# EAGLE design Qwiic_Spectral_Sensor-AS7265x-Offset-BottomJig (EAGLE 9.2.1)
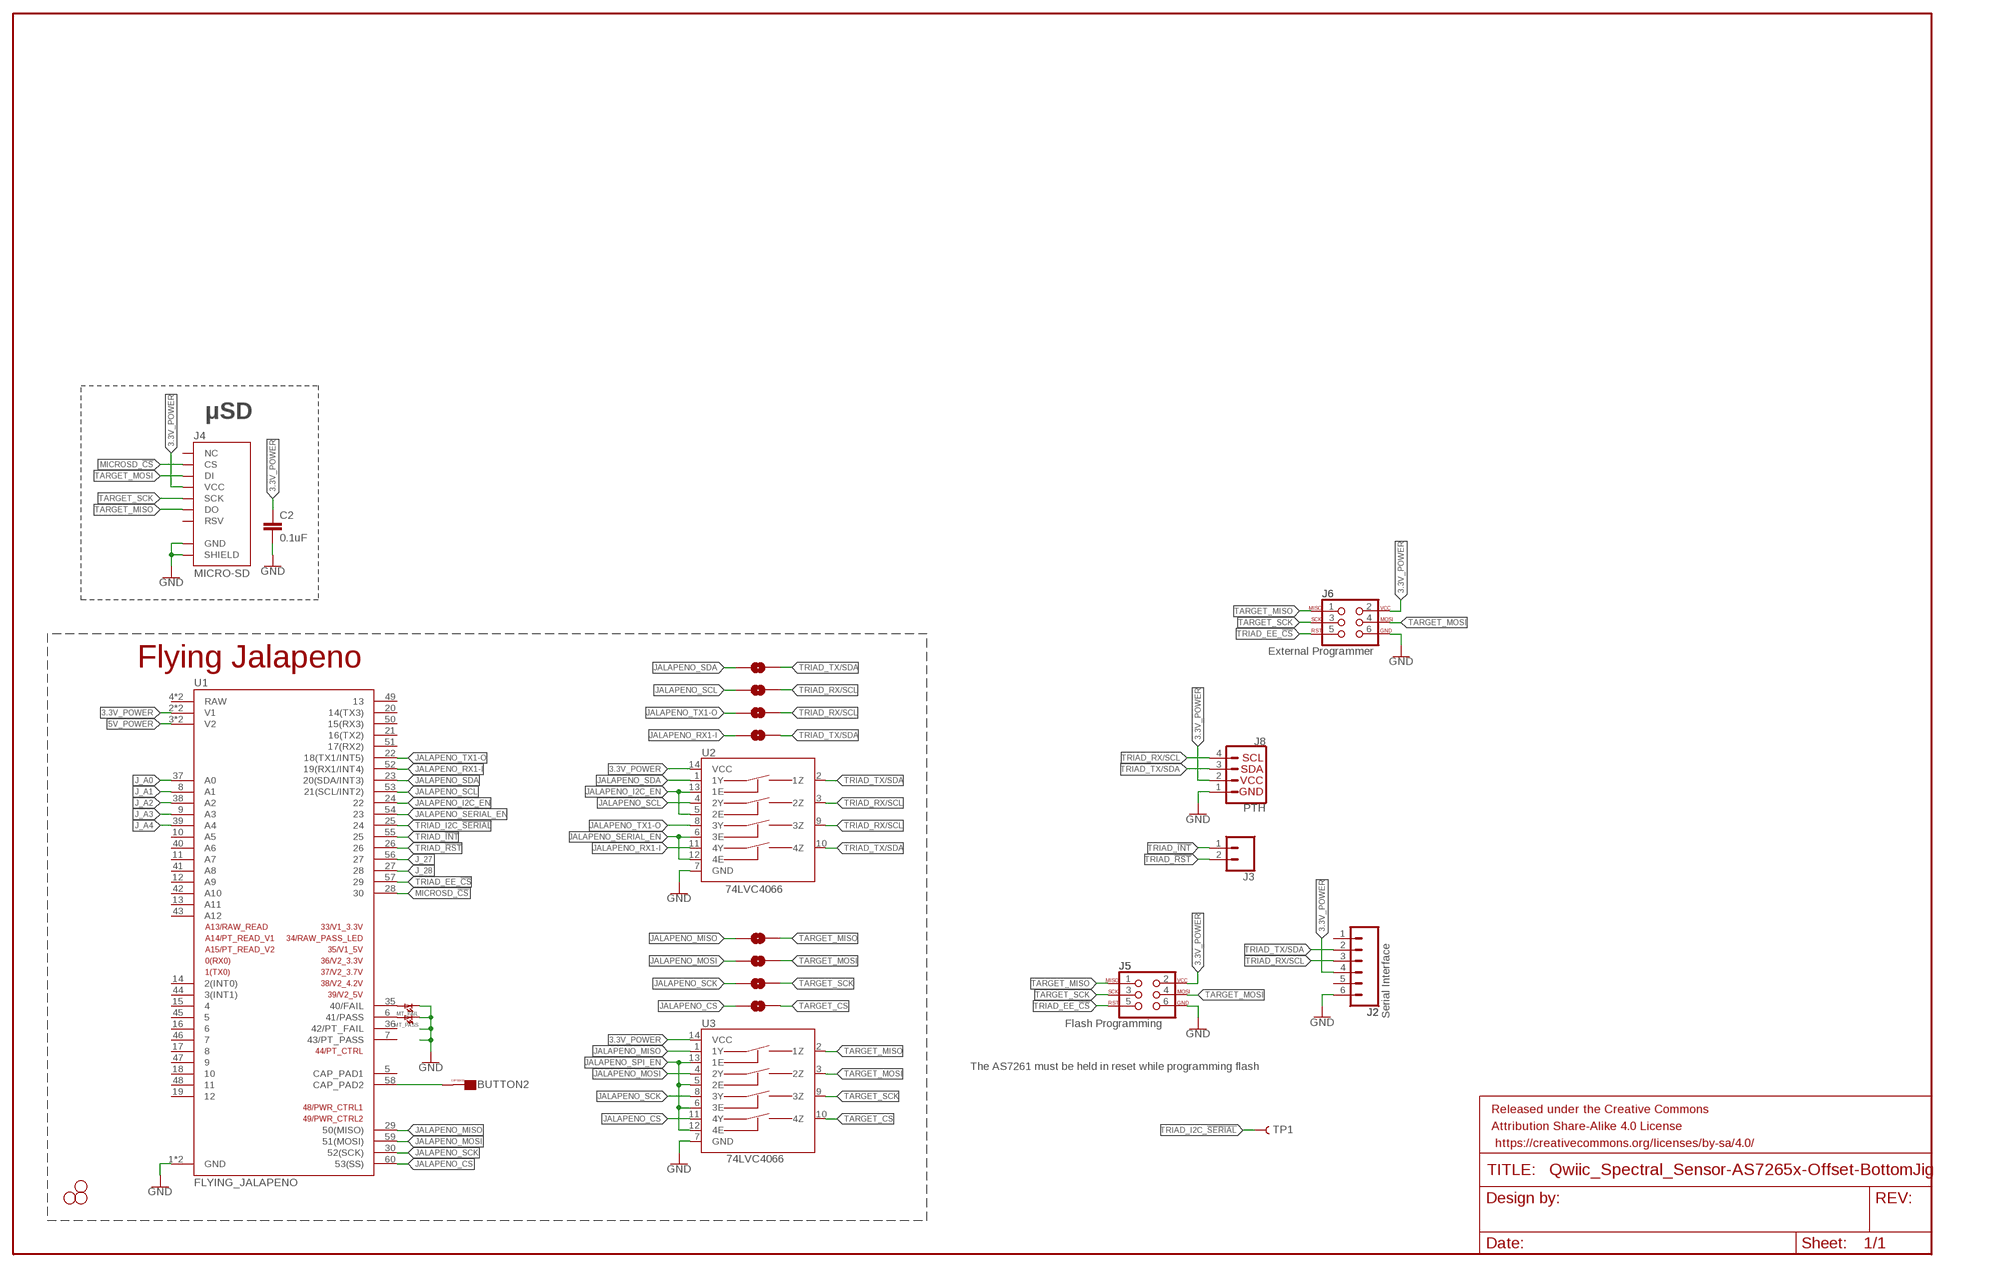
[diagram p0: schematic, sheet 1]

## Parts
BUTTON2  CAPSENSE_BUTTON_PAD_ONLY  [CAPSENSE_BUTTON_PADS_ONLY]
C2  0.1uF  0.1UF-0603-25V-(+80/-20%)  [0603]
FRAME2  FRAME-LEDGER  [CREATIVE_COMMONS]
H1  STAND-OFF  [STAND-OFF]
H3  STAND-OFF  [STAND-OFF]
H4  STAND-OFF  [STAND-OFF]
J2  Serial Interface  CONN_06NO_SILK_FEMALE_PTH  [1X06_NO_SILK]
J3  CONN_021X02_NO_SILK  [1X02_NO_SILK]
J4  MICRO-SD  MICRO-SD_CARD_SOCKETPUSH-PUSH  [MICRO-SD-SOCKET]
J5  Flash Programming  AVR_SPI_PROG_3X2NS  [2X3-NS]
J6  External Programmer  AVR_SPI_PROG_3X2NS  [2X3-NS]
J8  PTH  I2C_STANDARD_NO_SILK  [1X04_NO_SILK]
J_SCL  JUMPER-SMT_2_NO_NO-SILK  [SMT-JUMPER_2_NO_NO-SILK]
J_SCL1  JUMPER-SMT_2_NO_NO-SILK  [SMT-JUMPER_2_NO_NO-SILK]
J_SCL2  JUMPER-SMT_2_NO_NO-SILK  [SMT-JUMPER_2_NO_NO-SILK]
J_SCL3  JUMPER-SMT_2_NO_NO-SILK  [SMT-JUMPER_2_NO_NO-SILK]
J_SCL4  JUMPER-SMT_2_NO_NO-SILK  [SMT-JUMPER_2_NO_NO-SILK]
J_SCL5  JUMPER-SMT_2_NO_NO-SILK  [SMT-JUMPER_2_NO_NO-SILK]
J_SDA  JUMPER-SMT_2_NO_NO-SILK  [SMT-JUMPER_2_NO_NO-SILK]
J_SDA1  JUMPER-SMT_2_NO_NO-SILK  [SMT-JUMPER_2_NO_NO-SILK]
MT_FAIL  LED1206  [LED-1206]
MT_PASS  LED1206  [LED-1206]
TP1  TEST-POINTPOGO_PTH  [1X01_NO_SILK]
U1  FLYING_JALAPENO  FLYING_JALAPENO_V3MALE  [FLYING_JALAPENO_V3_M]
U2  74LVC4066  74LVC4066_MUX_1:1_X4  [SO14]
U3  74LVC4066  74LVC4066_MUX_1:1_X4  [SO14]

## Nets
3.3V_POWER [VCC]: C2.1 J2.4 J4.VCC J5.2 J6.2 J8.2 U1.2(V1) U1.32(V1) U2.14(VCC) U3.14(VCC)
5V_POWER [POWA]: U1.3(V2) U1.33(V2)
BUTTON2 [CAPSENSE]: BUTTON2.CAPSENSE_PAD(CAPSENSE) U1.58(CAP_PAD2)
GND: C2.2 J2.6 J4.CD1(SHIELD) J4.GND J5.6 J6.6 J8.1 MT_FAIL.C MT_PASS.C U1.1(GND) U1.31(GND) U2.7(GND) U3.7(GND)
J_27: U1.56
J_28: U1.27
J_A0: U1.37(A0)
J_A1: U1.8(A1)
J_A2: U1.38(A2)
J_A3: U1.9(A3)
J_A4: U1.39(A4)
JALAPENO_CS: J_SDA1.1 U1.60(53(SS)) U3.11(4Y)
JALAPENO_I2C_EN: U1.24 U2.5(2E) U2.13(1E)
JALAPENO_MISO: J_SCL5.1 U1.29(50(MISO)) U3.1(1Y)
JALAPENO_MOSI: J_SCL3.1 U1.59(51(MOSI)) U3.4(2Y)
JALAPENO_RX1-I: J_SDA.1 U1.52(19(RX1/INT4)) U2.11(4Y)
JALAPENO_SCK: J_SCL4.1 U1.30(52(SCK)) U3.8(3Y)
JALAPENO_SCL: J_SCL.1 U1.53(21(SCL/INT2)) U2.4(2Y)
JALAPENO_SDA: J_SCL2.1 U1.23(20(SDA/INT3)) U2.1(1Y)
JALAPENO_SERIAL_EN: U1.54 U2.6(3E) U2.12(4E)
JALAPENO_SPI_EN: U3.5(2E) U3.6(3E) U3.12(4E) U3.13(1E)
JALAPENO_TX1-O: J_SCL1.1 U1.22(18(TX1/INT5)) U2.8(3Y)
MICROSD_!CS!: J4.CS U1.28
N$15: MT_PASS.A U1.6(41/PASS)
N$16: MT_FAIL.A U1.35(40/FAIL)
TARGET_CS: J_SDA1.2 U3.10(4Z)
TARGET_MISO: J4.DO J5.1 J6.1 J_SCL5.2 U3.2(1Z)
TARGET_MOSI: J4.DI J5.4 J6.4 J_SCL3.2 U3.3(2Z)
TARGET_SCK: J4.SCLK(SCK) J5.3 J6.3 J_SCL4.2 U3.9(3Z)
TRIAD_!INT!: J3.1 U1.55
TRIAD_!RST!: J3.2 U1.26
TRIAD_EE_!CS!: J5.5 J6.5 U1.57
TRIAD_I2C_!SERIAL!: TP1.1 U1.25
TRIAD_RX/SCL: J2.3 J8.4 J_SCL1.2 J_SCL.2 U2.3(2Z) U2.9(3Z)
TRIAD_TX/SDA: J2.2 J8.3 J_SCL2.2 J_SDA.2 U2.2(1Z) U2.10(4Z)
Unconnected: J2.1 J2.5 J4.RSV1(RSV) J4.RSV2(NC) U1.4(RAW) U1.5(CAP_PAD1) U1.7(43/PT_PASS) U1.10(A5) U1.11(A7) U1.12(A9) U1.13(A11) U1.14(2(INT0)) U1.15 U1.16 U1.17 U1.18 U1.19 U1.20(14(TX3)) U1.21(16(TX2)) U1.34(RAW) U1.36(42/PT_FAIL) U1.40(A6) U1.41(A8) U1.42(A10) U1.43(A12) U1.44(3(INT1)) U1.45 U1.46 U1.47 U1.48 U1.49 U1.50(15(RX3)) U1.51(17(RX2))

## Notes on the sheet
- μSD
- Flying Jalapeno
- The AS7261 must be held in reset while programming flash

## Library data of the parts
BUTTON2 = Testing:CAPSENSE_BUTTON_PAD_ONLY
C2 = SparkFun-Capacitors:0.1UF: 0.1µF ceramic capacitors A capacitor is a passive two-terminal electrical component used to store electrical energy temporarily in an electric field.; PROD_ID: CAP-00810
FRAME2 = SparkFun-Aesthetics:FRAME-LEDGER: Schematic Frame - Ledger Standard 11x14 US Ledger frame
H1 H3 H4 = SparkFun-Hardware:STAND-OFF: Stand Off Drill holes for mechanically mounting via screws, standoffs, etc. Note: Use the keepout ring to avoid running the screw head into surrounding components. Variant Overviews STAND-OFF - Mechanical footprint for a #4 phillips button head screw. STAND-OFF-TIGHT - Mechanical footprint for a #4 phillips button head screw, Example SparkFun Products Screw - Phillips Head (1/4", 4-40, 10 pack) <https://www.sparkfun.com/products/10453> (PRT-10453) Screw - Phillips Head (1/2", 4-40, 10 pack) <https://www.sparkfun.com/products/10452> (PRT-10452) Screw - Phillips Head (3/4", 4-40, 10 pack) <https://www.sparkfun.com/products/10451> (PRT-10451) Screw - Phillips Head (1", 4-40, 10 pack) <https://www.sparkfun.com/products/10450> (PRT-10450)
J2 = SparkFun-Connectors:CONN_06: Multi connection point. Often used as Generic Header-pin footprint for 0.1 inch spaced/style header connections On any of the 0.1 inch spaced packages, you can populate with these: Break Away Headers - Straight <https://www.sparkfun.com/products/116> (PRT-00116) Break Away Male Headers - Right Angle <https://www.sparkfun.com/products/553> (PRT-00553) Female Headers <https://www.sparkfun.com/products/115> (PRT-00115) Break Away Headers - Machine Pin <https://www.sparkfun.com/products/117> (PRT-00117) Break Away Female Headers - Swiss Machine Pin <https://www.sparkfun.com/products/743> (PRT-00743) Arduino Stackable Header - 6 Pin <https://www.sparkfun.com/products/9280> (PRT-09280) For SCREWTERMINALS and SPRING TERMINALS visit here: Screw Terimnals on SparkFun.com <https://www.sparkfun.com/search/results?term=Screw+Terminals> (5mm/3.5mm/2.54mm spacing) This device is also useful as a general connection point to wire up your design to another part of your project. Our various solder wires solder well into these plated through hole pads. Hook-Up Wire - Assortment (Stranded, 22 AWG) <https://www.sparkfun.com/products/11375> (PRT-11375) Hook-Up Wire - Assortment (Solid Core, 22 AWG) <https://www.sparkfun.com/products/11367> (PRT-11367) View the entire wire category on our website here <https://www.sparkfun.com/categories/141>; PROD_ID: CONN-08437
J3 = SparkFun-Connectors:CONN_02: Multi connection point. Often used as Generic Header-pin footprint for 0.1 inch spaced/style header connections On any of the 0.1 inch spaced packages, you can populate with these: Break Away Headers - Straight <https://www.sparkfun.com/products/116> (PRT-00116) Break Away Male Headers - Right Angle <https://www.sparkfun.com/products/553> (PRT-00553) Female Headers <https://www.sparkfun.com/products/115> (PRT-00115) Break Away Headers - Machine Pin <https://www.sparkfun.com/products/117> (PRT-00117) Break Away Female Headers - Swiss Machine Pin <https://www.sparkfun.com/products/743> (PRT-00743) For SCREWTERMINALS and SPRING TERMINALS visit here: Screw Terimnals on SparkFun.com <https://www.sparkfun.com/search/results?term=Screw+Terminals> (5mm/3.5mm/2.54mm spacing) This device is also useful as a general connection point to wire up your design to another part of your project. Our various solder wires solder well into these plated through hole pads. Hook-Up Wire - Assortment (Stranded, 22 AWG) <https://www.sparkfun.com/products/11375> (PRT-11375) Hook-Up Wire - Assortment (Solid Core, 22 AWG) <https://www.sparkfun.com/products/11367> (PRT-11367) View the entire wire category on our website here <https://www.sparkfun.com/categories/141> Special notes: Molex polarized connector foot print use with: PRT-08233 with associated crimp pins and housings. 2.54_SCREWTERM for use with PRT-10571. 3.5mm Screw Terminal footprints for PRT-08084 5mm Screw Terminal footprints for use with PRT-08432
J4 = SparkFun-Connectors:MICRO-SD_CARD_SOCKET: microSD Socket for Transflash Push-push type µSD socket. tDoc lines correctly indicate media card edge positions when inserting (unlocked, locked, depressed). NOTE: CD1 and CD2 are connected internally, and the default detect state of the socket is detect pin to ground. SparkFun Products: WAV Trigger <https://www.sparkfun.com/products/13660> CAN-Bus Shield <https://www.sparkfun.com/products/13262> SparkFun Level Shifing microSD Breakout <https://www.sparkfun.com/products/13743>; PROD_ID: CONN-07820
J5 J6 = SparkFun-Connectors:AVR_SPI_PROG_3X2: AVR ISP 6 Pin This is the reduced ISP connector for AVR programming. Common on Arduino. This footprint will take up less PCB space and can be used with a 10-pin to 6-pin adapter such as SKU: BOB-08508 **Special note about "TEST_POINT" package. The stop mask is on the top side, so if you want your programming test points to be on the bottom of your board, make sure to place this package on the bottom side of the board. This also ensure that the orientation to program from the bottom side will be correct. SparkFun Products: SparkFun ISP Pogo Adapter <https://www.sparkfun.com/products/11591> - NS Tiny AVR Programmer <https://www.sparkfun.com/products/11801> -PTH
J8 = SparkFun-Connectors:I2C_STANDARD: SparkFun I2C Standard Pinout Header SparkFun has standardized on a pinout for all I2C based sensor breakouts. This pinout allows I2C boards to be plugged directly into the headers on Arduino Uno compatible boards, and to be daisy chained easily. Example SparkFun Products: SparkFun Atmospheric Sensor Breakout - BME280 <https://www.sparkfun.com/products/13676> SparkFun Altitude/Pressure Sensor Breakout - MPL3115A2 <https://www.sparkfun.com/products/11084> SparkFun TOF Range Finder Sensor - VL6180 <https://www.sparkfun.com/products/12785>
J_SCL J_SCL1-J_SCL5 J_SDA J_SDA1 = SparkFun-Jumpers:JUMPER-SMT_2_NO: Normally open jumper This jumper has two pads in close proximity to each other. Apply solder to close the connection. Round pads are easier to solder for beginners, but are a lot larger. SparkFun Product that uses the round pads: SparkFun EL Sequencer <https://www.sparkfun.com/products/12781>
MT_FAIL MT_PASS = Testing:LED: LEDs Standard schematic elements and footprints for 5mm, 3mm, 1206, and 0603 sized LEDs. 5mm - Spark Fun Electronics SKU : COM-00529 (and others)
TP1 = SparkFun-Connectors:TEST-POINT: SparkFun Test Points Bare copper test points for troubleshooting or In-Circuit-Testing. These are used by our Production team for verifying production board runs using pogo-pins on test beds. SparkFun Products: SparkFun LSM9DS1 Breakout <https://www.sparkfun.com/products/13284> SparkFun PSOC <https://www.sparkfun.com/products/13714> SparkFun Load Cell Amplifier <https://www.sparkfun.com/products/13879>
U1 = Testing:FLYING_JALAPENO_V3
U2 U3 = Testing:74LVC4066_MUX_1:1_X4

## Net classes
1 VCC: width 0.381 mm
2 POWA: width 0.61 mm
3 CAPSENSE: width 0.508 mm

## Board
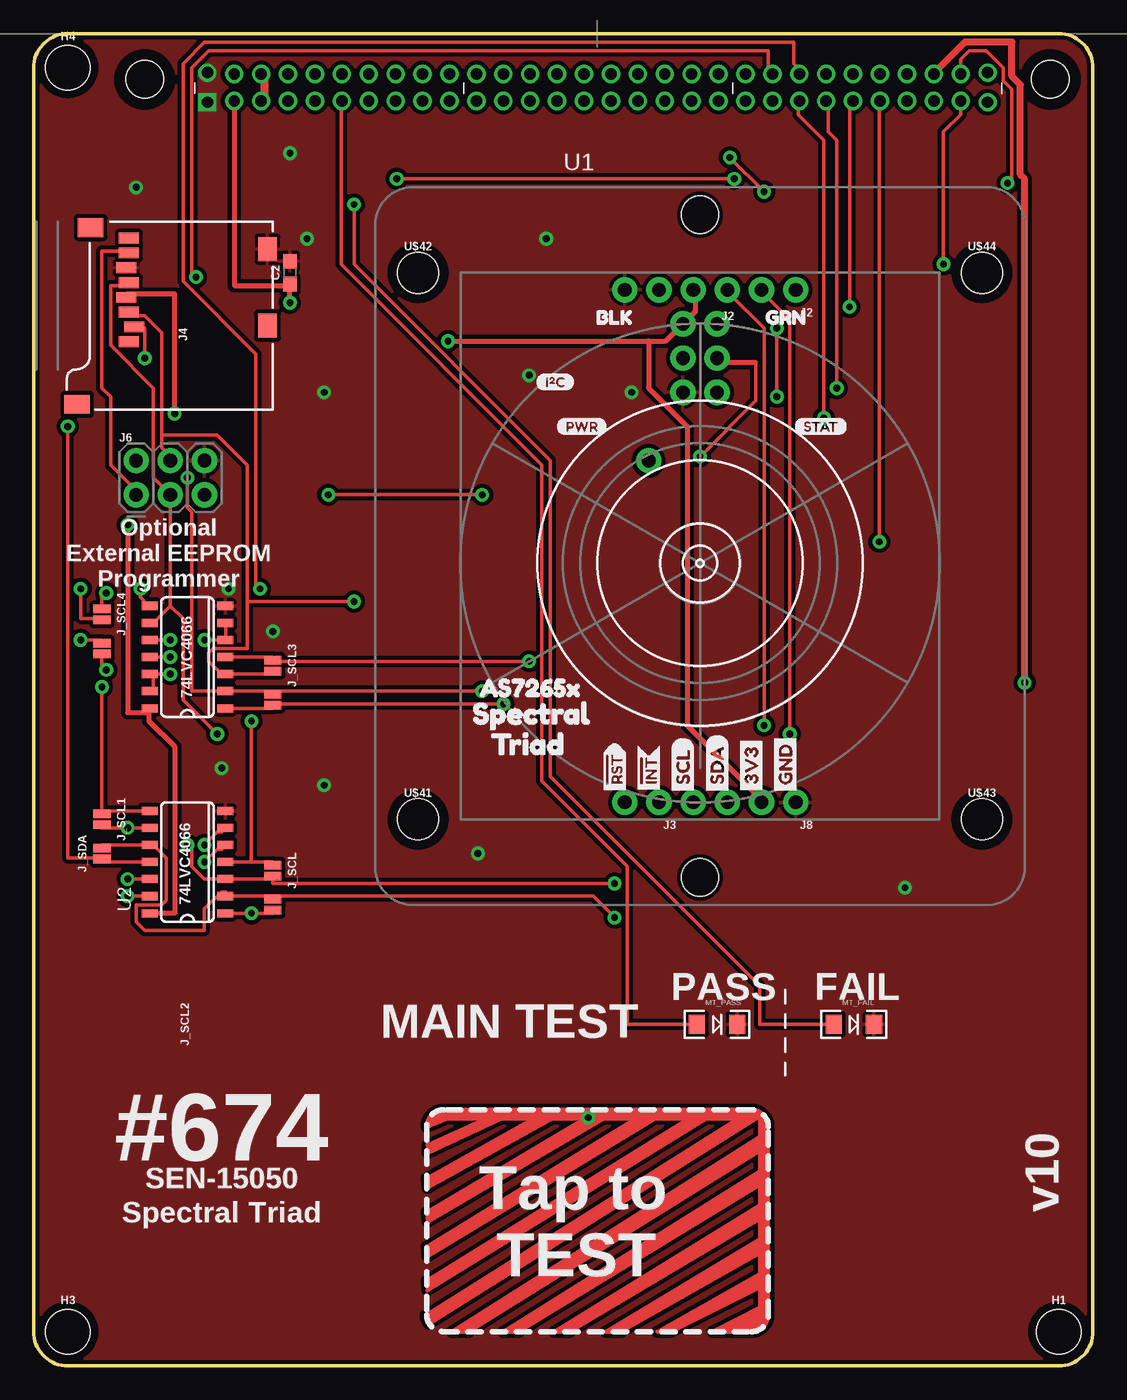
[diagram p1: board, top side]
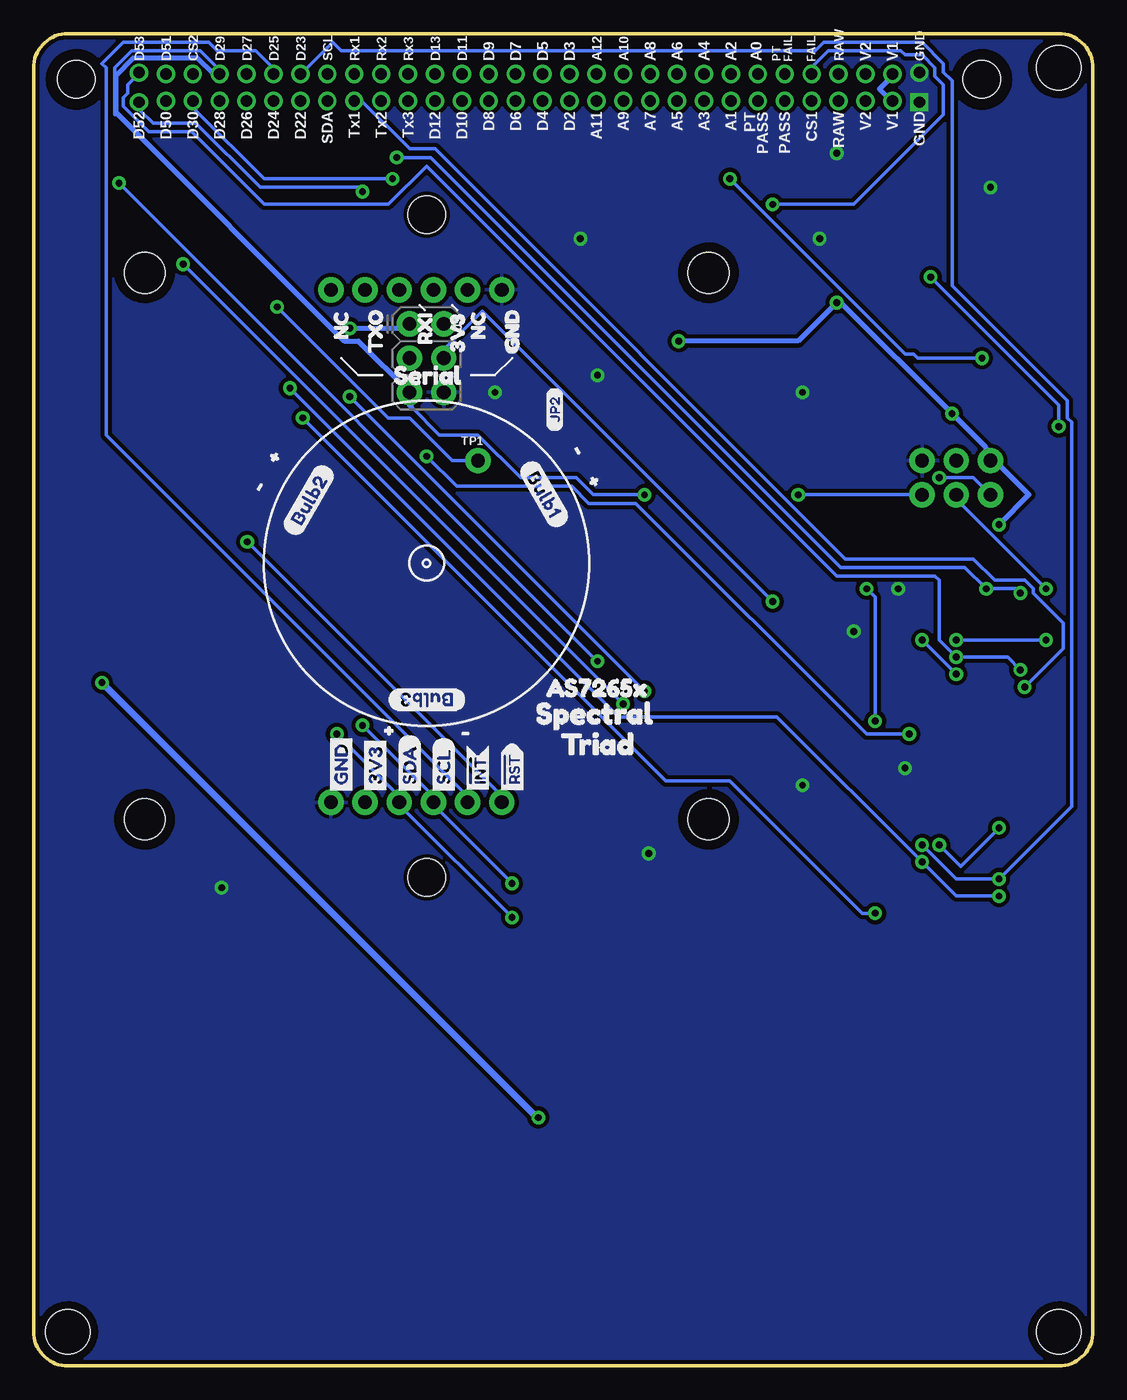
[diagram p2: board, bottom side, seen from below]

Size 78.74 x 99.06 mm. Coordinates in mm from the lower left corner, seen from the top.
Outline: 2.54,99.06 76.2,99.06 arc-90 78.74,96.52 78.74,2.54 arc-90 76.2,0 2.54,0 arc-90 0,2.54 0,96.52 arc-90 2.54,99.06
Copper layers (1*16): Top 0.035mm / dielectric 1.5mm / Bottom 0.035mm
Design rules "SparkFun-2-layer-STANDARD": minimum track width 10mil, minimum drill 20mil, track to track 10mil, track to pad 8mil, pad to pad 8mil, via to via 10mil, smd to smd 8mil, copper to edge 8mil, drill to drill 8mil, minimum pad ring 10mil, minimum via ring 10mil, stop-mask expansion 4mil, vias tented up to drill 25mil, thermal gap 10mil

### Footprints (pad centres in the part's own frame; a part is rotated, then mirrored left to right if it is on the bottom)
CAPSENSE_BUTTON_PADS_ONLY = drill 0.508: CAPSENSE_PAD -0.686,7.036
0603 = smd 1.1 x 1: 1 -0.85,0; 2 0.85,0
STAND-OFF = hole 3.302: 0,0
1X06_NO_SILK = drill 1.016 pad 1.88: 1 0,0; 2 2.54,0; 3 5.08,0; 4 7.62,0; 5 10.16,0; 6 12.7,0
1X02_NO_SILK = drill 1.016 pad 1.88: 1 0,0; 2 2.54,0
MICRO-SD-SOCKET = smd 1.8 x 1.4: CD1 -2.05,0.4; CD2 -7.75,0.4 | smd 0.8 x 1.5: CS -7.84,10.3; DI -6.74,10.7; DO -2.34,10.7; GND -3.44,10.9; RSV1 -8.94,10.7; RSV2 -1.24,10.7; SCLK -4.54,10.7; VCC -5.64,10.9 | smd 1.4 x 1.9: GND1 -13.6,14.55; GND3 -0.45,13.55
2X3-NS = drill 1.016 pad 1.88: 1 -2.54,-1.27; 2 -2.54,1.27; 3 0,-1.27; 4 0,1.27; 5 2.54,-1.27; 6 2.54,1.27
1X04_NO_SILK = drill 1.016 pad 1.88: 1 0,0; 2 2.54,0; 3 5.08,0; 4 7.62,0
SMT-JUMPER_2_NO_NO-SILK = smd 0.635 x 1.27: 1 -0.406,0; 2 0.406,0
LED-1206 = smd 1.2 x 1.4: A -1.5,0; C 1.5,0
1X01_NO_SILK = drill 1.016 pad 1.88: 1 0,0
FLYING_JALAPENO_V3_M = drill 0.85 square: 1 -29,-5.1 | drill 0.85: 2 -27,-5; 3 -25,-5; 4 -23,-5; 5 -21,-5; 6 -19,-5; 7 -17,-5; 8 -15,-5; 9 -13,-5; 10 -11,-5; 11 -9,-5; 12 -7,-5; 13 -5,-5; 14 -3,-5; 15 -1,-5; 16 1,-5; 17 3,-5; 18 5,-5; 19 7,-5; 20 9,-5; 21 11,-5; 22 13,-5; 23 15,-5; 24 17,-5; 25 19,-5; 26 21,-5; 27 23,-5; 28 25,-5; 29 27,-5; 30 29,-5.1; 31 -29,-2.9; 32 -27,-3; 33 -25,-3; 34 -23,-3; 35 -21,-3; 36 -19,-3; 37 -17,-3; 38 -15,-3; 39 -13,-3; 40 -11,-3; 41 -9,-3; 42 -7,-3; 43 -5,-3; 44 -3,-3; 45 -1,-3; 46 1,-3; 47 3,-3; 48 5,-3; 49 7,-3; 50 9,-3; 51 11,-3; 52 13,-3; 53 15,-3; 54 17,-3; 55 19,-3; 56 21,-3; 57 23,-3; 58 25,-3; 59 27,-3; 60 29,-2.9 | hole 2.794: 33.655,-3.404; -33.655,-3.404
SO14 = smd 0.6 x 1.2: 1 -3.175,-2.8; 2 -1.905,-2.8; 3 -0.635,-2.8; 4 0.635,-2.8; 5 1.905,-2.8; 6 3.175,-2.8; 7 4.445,-2.8; 8 4.445,2.8; 9 3.175,2.8; 10 1.905,2.8; 11 0.635,2.8; 12 -0.635,2.8; 13 -1.905,2.8; 14 -3.175,2.8
STAND-OFF-TIGHT = hole 3.048: 0,0
NUBBIN_LOCKER = hole 2.794: 0,0

### Placement (x,y rotation side)
BUTTON2  41.91,11.43 0 top
C2  19.05,81.28 90 top
FRAME2  11.43,-11.43 0 top  (outside the outline)
H1  76.2,2.54 0 top
H3  2.54,2.54 0 top
H4  2.54,96.52 0 top
J2  56.64,80.01 180 top
J3  46.48,41.91 180 top
J4  17.78,85.09 90 top
J5  49.53,74.93 270 bottom
J6  10.16,66.04 0 top
J8  56.64,41.91 180 top
J_SCL  17.78,36.83 270 top
J_SCL1  5.08,40.64 270 top
J_SCL2  17.78,34.29 90 top
J_SCL3  17.78,52.07 270 top
J_SCL4  5.08,55.88 270 top
J_SCL5  17.78,49.53 90 top
J_SDA  5.08,38.1 90 top
J_SDA1  5.08,53.34 90 top
MT_FAIL  60.96,25.4 0 top
MT_PASS  50.8,25.4 0 top
TP1  45.72,67.31 0 bottom
U1  41.91,99.06 0 top
U2  11.43,36.83 90 top
U3  11.43,52.07 90 top
U$1  [#0]  61.59,66.55 60 bottom
U$2  [I_SUPER2_C-()-03]  37.34,73.15 0 top
U$3  [PWR-()-03]  38.86,69.85 0 top
U$4  [AS7265X0]  32,50.42 0 top
U$5  [BULB15]  42.16,67.18 300 bottom
U$6  [BULB26]  59.82,61.72 60 bottom
U$7  [BULB37]  46.61,49.53 180 bottom
U$8  [JP20]  40.01,69.47 90 bottom
U$9  [SPECTRAL1]  31.24,48.51 0 top
U$10  [STAT4]  56.52,69.85 0 top
U$11  [TRIAD2]  32.64,46.23 0 top
U$12  [TRIAD2]  40.89,46.23 0 bottom
U$13  [SPECTRAL1]  42.8,48.51 0 bottom
U$14  [AS7265X0]  41.78,50.42 0 bottom
U$15  [3V33]  47.24,74.3 90 bottom
U$16  [BLK7]  40.89,77.98 0 top
U$17  [GND5]  43.18,74.55 90 bottom
U$18  [GRN6]  53.34,77.98 0 top
U$19  [NC4]  55.88,75.44 90 bottom
U$20  [NC4]  45.72,75.44 90 bottom
U$21  [RXI2]  49.66,75.06 90 bottom
U$22  [SERIAL0]  53.09,73.66 0 bottom
U$23  [TXO1]  53.34,74.42 90 bottom
U$24  [3V3-04]  53.34,42.29 90 bottom
U$25  [GND-04]  55.88,42.29 90 bottom
U$26  [SDA-[)]  50.8,42.29 90 bottom
U$27  [SCL-[)]  48.26,42.29 90 bottom
U$28  [INT#-[<-04]  45.72,42.16 90 bottom
U$29  [RST#-[>-04]  43.18,42.16 90 bottom
U$30  [GND-04]  55.88,42.29 90 top
U$31  [3V3-04]  53.34,42.29 90 top
U$32  [SDA-[)]  50.8,42.29 90 top
U$33  [SCL-[)]  48.26,42.29 90 top
U$34  [INT#-[<-04]  45.72,42.16 90 top
U$35  [RST#-[>-04]  43.18,42.16 90 top
U$36  [#0]  37.59,66.93 300 bottom
U$37  [#0]  53.59,47.37 0 bottom
U$38  [#1]  47.88,47.24 0 bottom
U$39  [#1]  38.73,69.22 300 bottom
U$40  [#1]  62.74,64.39 60 bottom
U$41  [STAND-OFF-TIGHT]  28.58,40.64 0 top
U$42  [STAND-OFF-TIGHT]  28.58,81.28 0 top
U$43  [STAND-OFF-TIGHT]  70.48,40.64 0 top
U$44  [STAND-OFF-TIGHT]  70.48,81.28 0 top
U$45  [NUBBIN_LOCKER]  49.53,36.32 0 top
U$46  [NUBBIN_LOCKER]  49.53,85.6 0 top

### Tracks (layer width: path | path; a pad name or v marks a point on that pad's centre or on a via)
3.3V_POWER  (via drill 0.51)
  Top 0.381: J2.4 49.21,79.69 49.21,78.42 J5.2 46.99,76.2 45.72,76.2 | 45.72,76.2 45.72,72.71 48.58,69.85 48.58,47.62 53.98,42.23 J8.2 | 19.05,80.33 14.92,80.33 14.92,93.98 U1.2 | U2.14 10.48,33.66 10.48,46.04 8.57,47.94 8.57,48.58 | 8.57,48.58 8.57,48.9 U3.14 | v10.48,70.8 10.48,79.69 6.99,79.69 J4.VCC | 8.57,48.58 6.99,48.58 v6.99,62.55 | v19.05,79.06 19.05,80.33 | 19.05,80.33 C2.1 | v30.8,76.2 45.72,76.2
  Bottom 0.381: U1.32 14.92,95.89 15.88,94.93 14.92,93.98 U1.2 | 7.94,67.94 7.94,67.63 J6.2 7.94,67.94 | 7.94,67.94 7.94,68.26 v10.48,70.8 18.73,79.06 v19.05,79.06 21.91,76.2 v30.8,76.2 | v6.99,62.55 4.76,64.77 7.94,67.94
5V_POWER
  Top 0.61: U1.3 17.14,94.3 17.14,95.89 U1.33
BUTTON2  (via drill 0.51)
  Top 0.508: v73.66,50.8 73.66,88.27 73.34,88.58 73.34,95.25 72.71,95.89 72.71,98.42 69.22,98.42 66.99,96.2 U1.58
  Bottom 0.508: v73.66,50.8 41.27,18.41 BUTTON2.CAPSENSE_PAD
GND  (via drill 0.51)
  other vias: 44.45,72.39 36.83,73.66 21.59,72.39 38.1,83.82 17.78,54.61 14.48,57.78 13.97,44.45 64.77,35.56 33.02,38.1 21.59,43.18 20.32,83.82 7.62,87.63 19.05,90.17
  pour Top (isolate 0.305): 0,99.06 78.74,99.06 78.74,0 0,0
  pour Bottom (isolate 0.305): 0,99.06 78.74,99.06 78.74,0 0,0
JALAPENO_CS  (via drill 0.51)
  Top 0.254: v10.16,52.7 U3.11 | v5.4,51.75 5.08,52.07 J_SDA1.1
  Bottom 0.254: v5.4,51.75 6.35,52.7 v10.16,52.7 11.43,53.98 11.43,58.42 11.75,58.74 19.05,58.74 49.53,89.22 52.39,86.36 61.59,86.36 66.99,91.76 70.17,91.76 72.07,93.66 72.07,94.3 71.75,94.61 71.75,95.25 71.12,95.89 U1.60
JALAPENO_I2C_EN  (via drill 0.51)
  Top 0.254: v6.99,34.92 U2.13 | v12.7,37.47 13.65,38.42 13.97,38.42 13.97,38.73 U2.5 | v59.69,72.71 59.69,91.12 59.05,91.76 59.05,93.98 U1.24
  Bottom 0.254: v6.99,34.92 10.16,34.92 v12.7,37.47 23.5,48.26 35.24,48.26 v59.69,72.71
JALAPENO_MISO  (via drill 0.51)
  Top 0.254: U3.1 17.78,48.9 J_SCL5.1 17.78,49.21 v34.92,49.21 | v67.63,81.92 67.63,91.76 68.9,93.03 68.9,93.98 U1.29
  Bottom 0.254: v67.63,81.92 v34.92,49.21
JALAPENO_MOSI  (via drill 0.51)
  Top 0.254: U3.4 17.78,52.7 J_SCL3.1 17.78,52.39 v36.83,52.39 | v72.39,87.95 72.71,88.27 72.71,94.93 72.07,95.57 72.07,96.52 70.8,97.79 69.53,97.79 68.9,97.16 68.9,96.2 U1.59
  Bottom 0.254: v72.39,87.95 v36.83,52.39
JALAPENO_RX1-I  (via drill 0.51)
  Top 0.254: U2.11 5.08,37.47 J_SDA.1 5.08,37.78 2.54,37.78 v2.54,69.85 | v12.06,80.96 11.75,81.28 11.75,96.52 13.02,97.79 54.61,97.79 54.61,96.2 U1.52
  Bottom 0.254: v2.54,69.85 2.54,71.44 v12.06,80.96
JALAPENO_SCK  (via drill 0.51)
  Top 0.254: v7.94,57.78 7.94,57.15 8.57,56.52 U3.8 | v5.4,57.47 5.08,57.15 J_SCL4.1 | v51.75,89.85 v54.29,87.31
  Bottom 0.254: v5.4,57.47 5.71,57.78 v7.94,57.78 9.53,59.37 18.73,59.37 49.21,89.85 v51.75,89.85 | v54.29,87.31 54.61,87.63 61.91,87.63 66.67,92.39 69.85,92.39 70.8,93.34 70.8,93.66 U1.30
JALAPENO_SCL  (via drill 0.51)
  Top 0.254: 16.19,37.47 17.78,37.47 J_SCL.1 | 16.19,37.47 U2.4 | v16.19,47.94 16.19,37.47 | v16.83,57.78 16.51,58.1 16.51,75.25 11.11,80.64 11.11,96.84 12.7,98.42 56.52,98.42 56.52,96.84 56.83,96.52 56.83,96.2 U1.53
  Bottom 0.254: v16.19,47.94 16.19,57.15 v16.83,57.78
JALAPENO_SDA  (via drill 0.51)
  Top 0.254: U2.1 v16.19,33.66 17.78,33.66 J_SCL2.1 | v58.74,70.48 58.74,91.12 56.83,93.03 56.83,93.98 U1.23
  Bottom 0.254: v16.19,33.66 17.14,33.66 26.99,43.5 31.75,43.5 v58.74,70.48
JALAPENO_SERIAL_EN  (via drill 0.51)
  Top 0.254: v6.99,36.2 U2.12 | v12.7,38.73 13.65,39.69 13.97,39.69 13.97,40.01 U2.6
  Bottom 0.254: v12.7,38.73 10.16,36.2 v6.99,36.2 1.59,41.59 1.59,70.17 1.91,70.48 1.91,71.75 10.48,80.33 10.48,95.57 11.11,96.2 11.11,96.84 12.7,98.42 20,98.42 20.64,97.79 55.88,97.79 56.52,98.42 58.74,96.2 U1.54
JALAPENO_SPI_EN  (via drill 0.51)
  Top 0.254: 8.89,51.44 8.89,50.16 U3.13 | U3.6 14.29,55.24 14.29,53.98 U3.5 v12.7,53.98 | v10.16,51.44 8.89,51.44 | 8.89,51.44 U3.12
  Bottom 0.254: v12.7,53.98 v10.16,51.44
JALAPENO_TX1-O  (via drill 0.51)
  Top 0.254: 5.08,41.27 U2.8 | v5.08,50.48 5.08,41.27 | 5.08,41.27 J_SCL1.1
  Bottom 0.254: v5.08,50.48 2.22,53.34 2.22,55.24 4.45,57.47 4.45,57.78 5.08,58.42 7.3,58.42 8.89,60.01 18.41,60.01 48.9,90.49 50.8,90.49 54.61,94.3 U1.22
MICROSD_!CS!  (via drill 0.51)
  Top 0.254: v8.26,74.93 8.26,77.15 7.62,77.15 J4.CS | v52.07,88.27 v26.99,88.27
  Bottom 0.254: v8.26,74.93 13.02,74.93 13.34,75.25 13.97,75.25 v26.99,88.27 | v52.07,88.27 61.59,88.27 66.67,93.34 66.67,93.98 U1.28
N$15
  Top 0.254: MT_PASS.A 44.13,25.4 44.13,37.15 37.78,43.5 37.78,66.99 22.86,81.92 22.86,93.98 U1.6
N$16  (via drill 0.51)
  Top 0.254: MT_FAIL.A 53.98,25.4 53.98,28.26 38.42,43.81 38.42,67.31 23.81,81.92 v23.81,86.36
  Bottom 0.254: v23.81,86.36 17.78,86.36 11.11,93.03 11.11,95.25 11.75,95.89 11.75,96.52 12.7,97.47 13.97,97.47 14.29,97.79 19.68,97.79 20.95,96.52 20.64,96.2 U1.35
TARGET_CS  (via drill 0.51)
  Top 0.254: v10.16,53.98 U3.10 | v3.49,53.98 5.08,53.98 J_SDA1.2
  Bottom 0.254: v3.49,53.98 v10.16,53.98
TARGET_MISO  (via drill 0.51)
  Top 0.254: 17.78,50.16 U3.2 11.75,50.16 11.75,63.5 11.43,63.82 v11.43,66.04 | J6.1 7.62,65.09 5.71,66.99 5.71,72.07 5.08,72.71 5.08,82.87 6.99,82.87 J4.DO | v55.24,72.07 v55.24,77.15 | 17.78,50.16 v33.34,50.16 | 17.78,50.16 J_SCL5.2
  Bottom 0.254: v11.43,66.04 8.89,66.04 J6.1 | v33.34,50.16 v55.24,72.07
  Bottom 0.381: v55.24,77.15 51.12,77.15 J5.1
TARGET_MOSI  (via drill 0.51)
  Top 0.254: J_SCL3.2 17.78,51.44 U3.3 13.97,51.44 13.02,52.39 13.02,53.02 13.34,53.34 15.88,53.34 15.88,56.83 | 9.53,69.22 9.53,68.26 10.16,67.63 J6.4 | 9.53,69.22 9.53,76.83 8.26,78.11 7.3,78.11 J4.DI | 15.88,56.83 15.88,66.99 13.65,69.22 9.53,69.22 | 15.88,56.83 v23.81,56.83
  Bottom 0.254: 48.26,75.56 45.4,78.42 v23.81,56.83
  Bottom 0.381: J5.4 48.26,75.56 | 48.26,75.56
TARGET_SCK  (via drill 0.51)
  Top 0.254: 10.16,56.52 8.89,55.24 U3.9 | 10.16,56.52 J6.3 8.89,66.04 8.89,72.71 5.71,75.88 5.71,80.33 6.99,80.33 J4.SCLK | v3.49,57.78 3.49,55.56 5.08,55.56 J_SCL4.2 | 53.66,74.61 53.66,71.75 v49.53,67.63 | v13.65,46.99 11.11,49.53 11.11,55.56 10.16,56.52
  Top 0.381: 53.66,74.61 51.12,74.61 J5.3
  Bottom 0.254: v3.49,57.78 10.16,64.45 J6.3 | v49.53,67.63 47.31,65.41 38.73,65.41 37.47,64.14 33.97,64.14 16.83,46.99 v13.65,46.99
TRIAD_!INT!
  Bottom 0.254: U1.55 60.96,96.2 60.96,96.52 62.23,97.79 65.09,97.79 65.72,98.42 72.07,98.42 73.66,96.84 73.34,96.52 73.34,69.22 46.35,42.23 J3.1
TRIAD_!RST!  (via drill 0.51)
  Top 0.254: v62.87,61.28 62.87,93.98 U1.26
  Bottom 0.254: v62.87,61.28 43.81,42.23 J3.2
TRIAD_EE_!CS!  (via drill 0.51)
  Top 0.254: v33.34,64.77 v21.91,64.77
  Bottom 0.254: 72.71,93.03 72.71,96.52 71.44,97.79 66.36,97.79 65.09,96.52 65.09,96.2 U1.57 | v21.91,64.77 J6.5 | v33.34,64.77 37.15,64.77 38.42,66.04 42.55,66.04 45.72,69.22 48.58,69.22 50.64,71.28 50.74,71.37
  Bottom 0.381: U1.57 65.39,96.06 66.57,97.23 71.35,97.23 72.64,95.94 72.64,93.2 55.64,76.2 54.61,76.2 J5.5 50.8,71.44 50.64,71.28
TRIAD_I2C_!SERIAL!  (via drill 0.51)
  Top 0.254: v60.64,78.74 60.64,93.98 U1.25
  Bottom 0.254: v60.64,78.74 52.39,70.48 50.8,70.48 47.62,67.31 TP1.1
TRIAD_RX/SCL  (via drill 0.51)
  Top 0.254: U2.9 v6.99,40.01 5.08,40.01 J_SCL1.2 | 17.78,36.2 U2.3 12.7,36.2 11.75,37.15 11.75,38.42 v11.43,38.73 | v43.18,35.88 17.78,35.88 17.78,36.2 | 17.78,36.2 J_SCL.2 | v54.29,47.62 54.29,77.15 51.75,79.69 J2.3
  Bottom 0.254: v6.99,40.01 9.84,37.15 v11.43,38.73 | v43.18,35.88 48.9,41.59 48.9,41.91 J8.4 48.9,42.23 v54.29,47.62
TRIAD_TX/SDA  (via drill 0.51)
  Top 0.254: J_SDA.2 5.08,38.73 U2.10 8.89,38.73 9.84,37.78 9.84,34.61 9.53,34.29 7.62,34.29 7.62,33.02 8.26,32.38 12.7,32.38 12.7,33.97 13.97,35.24 14.29,35.24 14.29,34.92 | 17.78,34.92 14.29,34.92 | 14.29,34.92 U2.2 | v43.18,33.34 41.59,34.92 17.78,34.92 | 17.78,34.92 J_SCL2.2 | v56.2,46.99 56.2,77.79 54.29,79.69 J2.2
  Bottom 0.254: v43.18,33.34 51.44,41.59 51.44,41.91 J8.3 51.44,42.23 v56.2,46.99

### Text on the board
tPlace: Optional / External EEPROM / Programmer | PASS | FAIL | MAIN TEST | #674 | SEN-15050 | Spectral Triad | v10 | Tap to / TEST
bPlace: GND